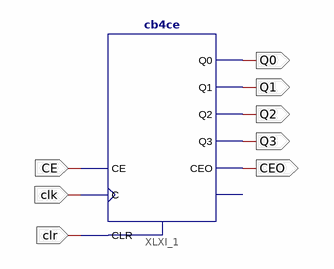
[diagram p0: schematic sheet 1]
// Xilinx ISE schematic task1.sch (spartan6) as structural Verilog: 1 symbols, 8 ports
module task1 (
  input  clk,
  input  clr,
  input  CE,
  output Q0,
  output Q1,
  output Q2,
  output Q3,
  output CEO
);

  cb4ce XLXI_1 (.C(clk), .CE(CE), .CLR(clr), .CEO(CEO), .Q0(Q0), .Q1(Q1), .Q2(Q2), .Q3(Q3));  // open: TC
endmodule
